# Altium project Main_MCU_Board.PrjPcb
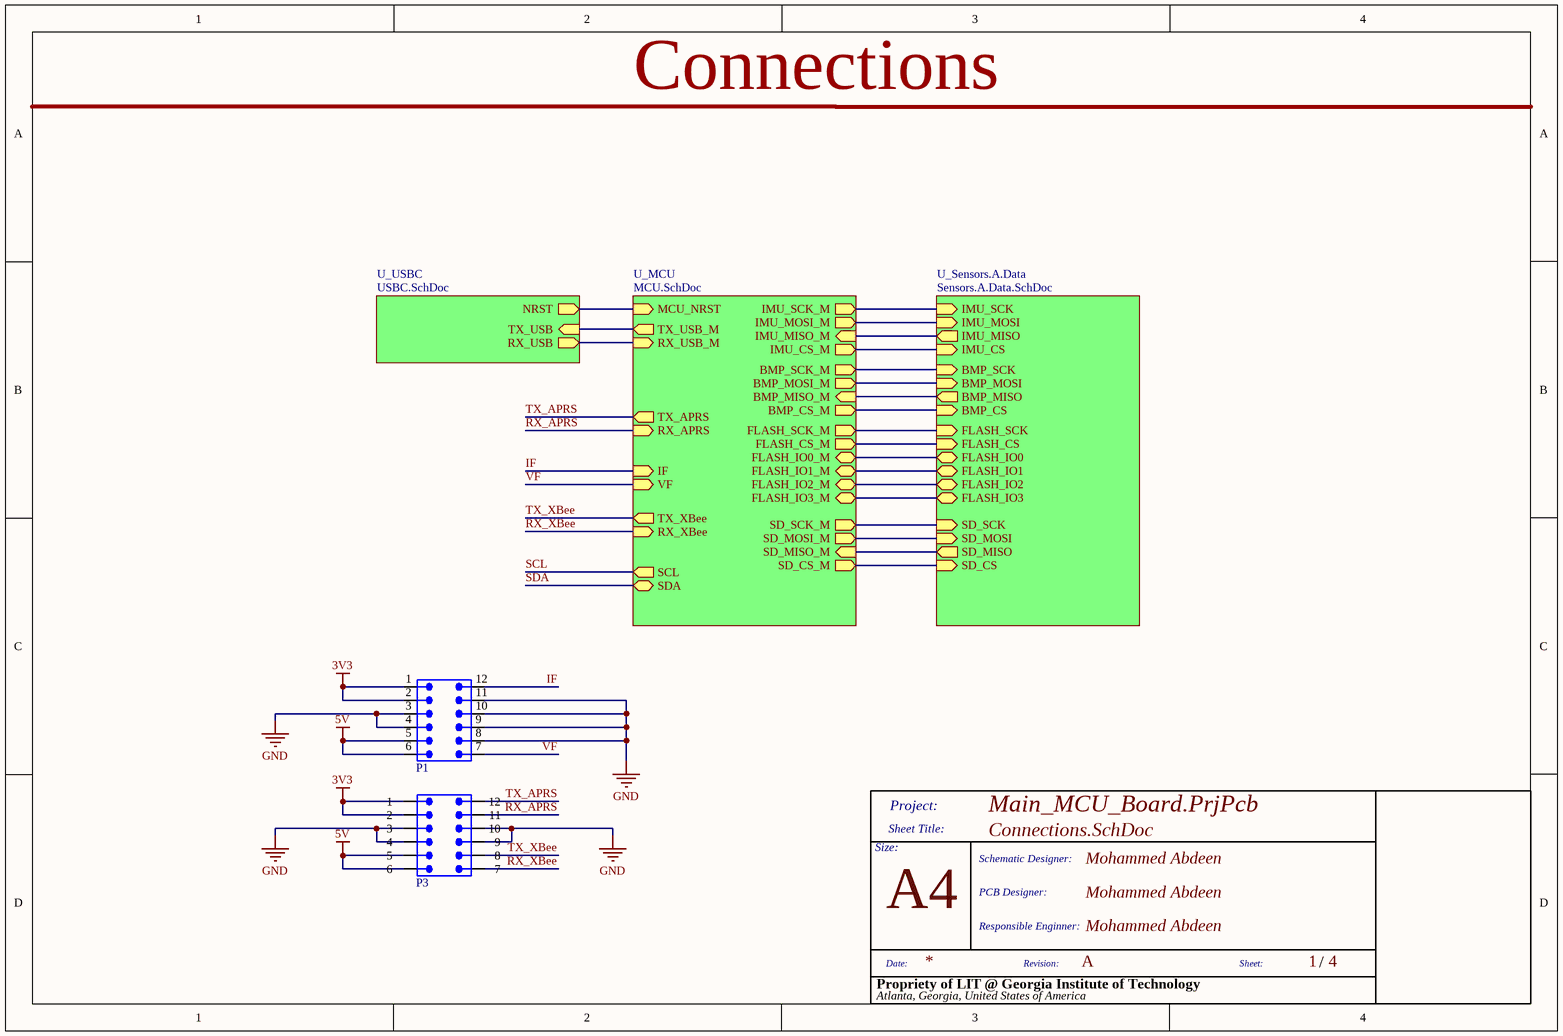
[diagram p0: Connections.SchDoc]
PCB_Engineer: Mohammed Abdeen; RE: Mohammed Abdeen; SCH_Engineer: Mohammed Abdeen; VersionRevision: A
4 sheets, 53 parts. Net scope: hierarchical (ports join the sheet entries above them; power ports are global).
Board file: MainBoard.PcbDoc
Sheets:
  Connections.SchDoc
    U_Sensors.A.Data = Sensors.A.Data.SchDoc
    U_USBC = USBC.SchDoc
    U_MCU = MCU.SchDoc

## Sheet Connections.SchDoc
size A4; SheetNumber: 1; SheetTotal: 4

### Parts
(Parts that share a designator on the sheet are numbered #1, #2 ... from top to bottom, then left to right.)
*#1  Size: A4  (hidden comment: TitleBlock)  (graphical)
P1  HTST-106-01-L-DV-P-TR  [HTST-106-01-L-DV-P-TR]  (value not drawn)
P3  NPPC062KFMS-RC  [NPPC062KFMS-RC]  (value not drawn)

### Sub-sheets
U_MCU = MCU.SchDoc: MCU_NRST (in), IF (in), VF (in), SD_MOSI_M (out), SD_MISO_M (in), SD_SCK_M (out), SD_CS_M (out), TX_APRS (out), RX_APRS (in), RX_XBee (in), TX_XBee (out), BMP_SCK_M (out), BMP_MISO_M (in), BMP_MOSI_M (out), BMP_CS_M (out), SCL (out), SDA (bidir), IMU_SCK_M (out), IMU_MISO_M (in), IMU_MOSI_M (out), IMU_CS_M (out), TX_USB_M (out), RX_USB_M (in), FLASH_IO3_M (bidir), FLASH_IO2_M (bidir), FLASH_IO1_M (bidir), FLASH_IO0_M (bidir), FLASH_SCK_M (out), FLASH_CS_M (out)
U_Sensors.A.Data = Sensors.A.Data.SchDoc: IMU_SCK (in), IMU_MOSI (in), IMU_MISO (out), IMU_CS (in), BMP_SCK (in), BMP_MOSI (in), BMP_MISO (out), BMP_CS (in), SD_CS (in), SD_MOSI (in), SD_SCK (in), SD_MISO (out), FLASH_CS (in), FLASH_SCK (in), FLASH_IO3 (bidir), FLASH_IO0 (bidir), FLASH_IO1 (bidir), FLASH_IO2 (bidir)
U_USBC = USBC.SchDoc: NRST (out), TX_USB (in), RX_USB (out)

### Nets
3V3: P1.1 P1.2 P3.11(2) P3.12(1)
5V: P1.5 P1.6 P3.7(6) P3.8(5)
GND: P1.3 P1.4 P1.8 P1.9 P1.10 P1.11 P3.3(10) P3.4(9) P3.9(4) P3.10(3)
BMP_CS: sheet U_Sensors.A.Data/BMP_CS, sheet U_MCU/BMP_CS_M
BMP_MISO: sheet U_Sensors.A.Data/BMP_MISO, sheet U_MCU/BMP_MISO_M
BMP_MOSI: sheet U_Sensors.A.Data/BMP_MOSI, sheet U_MCU/BMP_MOSI_M
BMP_SCK: sheet U_Sensors.A.Data/BMP_SCK, sheet U_MCU/BMP_SCK_M
FLASH_CS: sheet U_Sensors.A.Data/FLASH_CS, sheet U_MCU/FLASH_CS_M
FLASH_IO0: sheet U_Sensors.A.Data/FLASH_IO0, sheet U_MCU/FLASH_IO0_M
FLASH_IO1: sheet U_Sensors.A.Data/FLASH_IO1, sheet U_MCU/FLASH_IO1_M
FLASH_IO2: sheet U_Sensors.A.Data/FLASH_IO2, sheet U_MCU/FLASH_IO2_M
FLASH_IO3: sheet U_Sensors.A.Data/FLASH_IO3, sheet U_MCU/FLASH_IO3_M
FLASH_SCK: sheet U_Sensors.A.Data/FLASH_SCK, sheet U_MCU/FLASH_SCK_M
IF: P1.12 ; sheet U_MCU/IF
IMU_CS: sheet U_Sensors.A.Data/IMU_CS, sheet U_MCU/IMU_CS_M
IMU_MISO: sheet U_Sensors.A.Data/IMU_MISO, sheet U_MCU/IMU_MISO_M
IMU_MOSI: sheet U_Sensors.A.Data/IMU_MOSI, sheet U_MCU/IMU_MOSI_M
IMU_SCK: sheet U_Sensors.A.Data/IMU_SCK, sheet U_MCU/IMU_SCK_M
NRST: sheet U_USBC/NRST, sheet U_MCU/MCU_NRST
RX_APRS: P3.2(11) ; sheet U_MCU/RX_APRS
RX_USB: sheet U_USBC/RX_USB, sheet U_MCU/RX_USB_M
RX_XBee: P3.6(7) ; sheet U_MCU/RX_XBee
SD_CS: sheet U_Sensors.A.Data/SD_CS, sheet U_MCU/SD_CS_M
SD_MISO: sheet U_Sensors.A.Data/SD_MISO, sheet U_MCU/SD_MISO_M
SD_MOSI: sheet U_Sensors.A.Data/SD_MOSI, sheet U_MCU/SD_MOSI_M
SD_SCK: sheet U_Sensors.A.Data/SD_SCK, sheet U_MCU/SD_SCK_M
TX_APRS: P3.1(12) ; sheet U_MCU/TX_APRS
TX_USB: sheet U_USBC/TX_USB, sheet U_MCU/TX_USB_M
TX_XBee: P3.5(8) ; sheet U_MCU/TX_XBee
VF: P1.7 ; sheet U_MCU/VF

### Notes on the sheet
- Connections
- (in symbol TitleBlock) Project:; Sheet Title:; Size:; Schematic Designer:; PCB Designer:; Responsible Enginner:; Date:; Revision:; Sheet:; /; Propriety of LIT @ Georgia Institute of Technology; Atlanta, Georgia, United States of America

### Library data of the parts
*#1 = TitleBlock: Standard Title Block
P1 = BoardToBoard_Bottom: Connector Header Through Hole 12 position 0.100" (2.54mm)
P3 = BoardToBoard_Top: 12 Position Receptacle Connector 0.100" (2.54mm) Through Hole Gold

## Sheet Sensors.A.Data.SchDoc
size A4; SheetNumber: 3; SheetTotal: 4
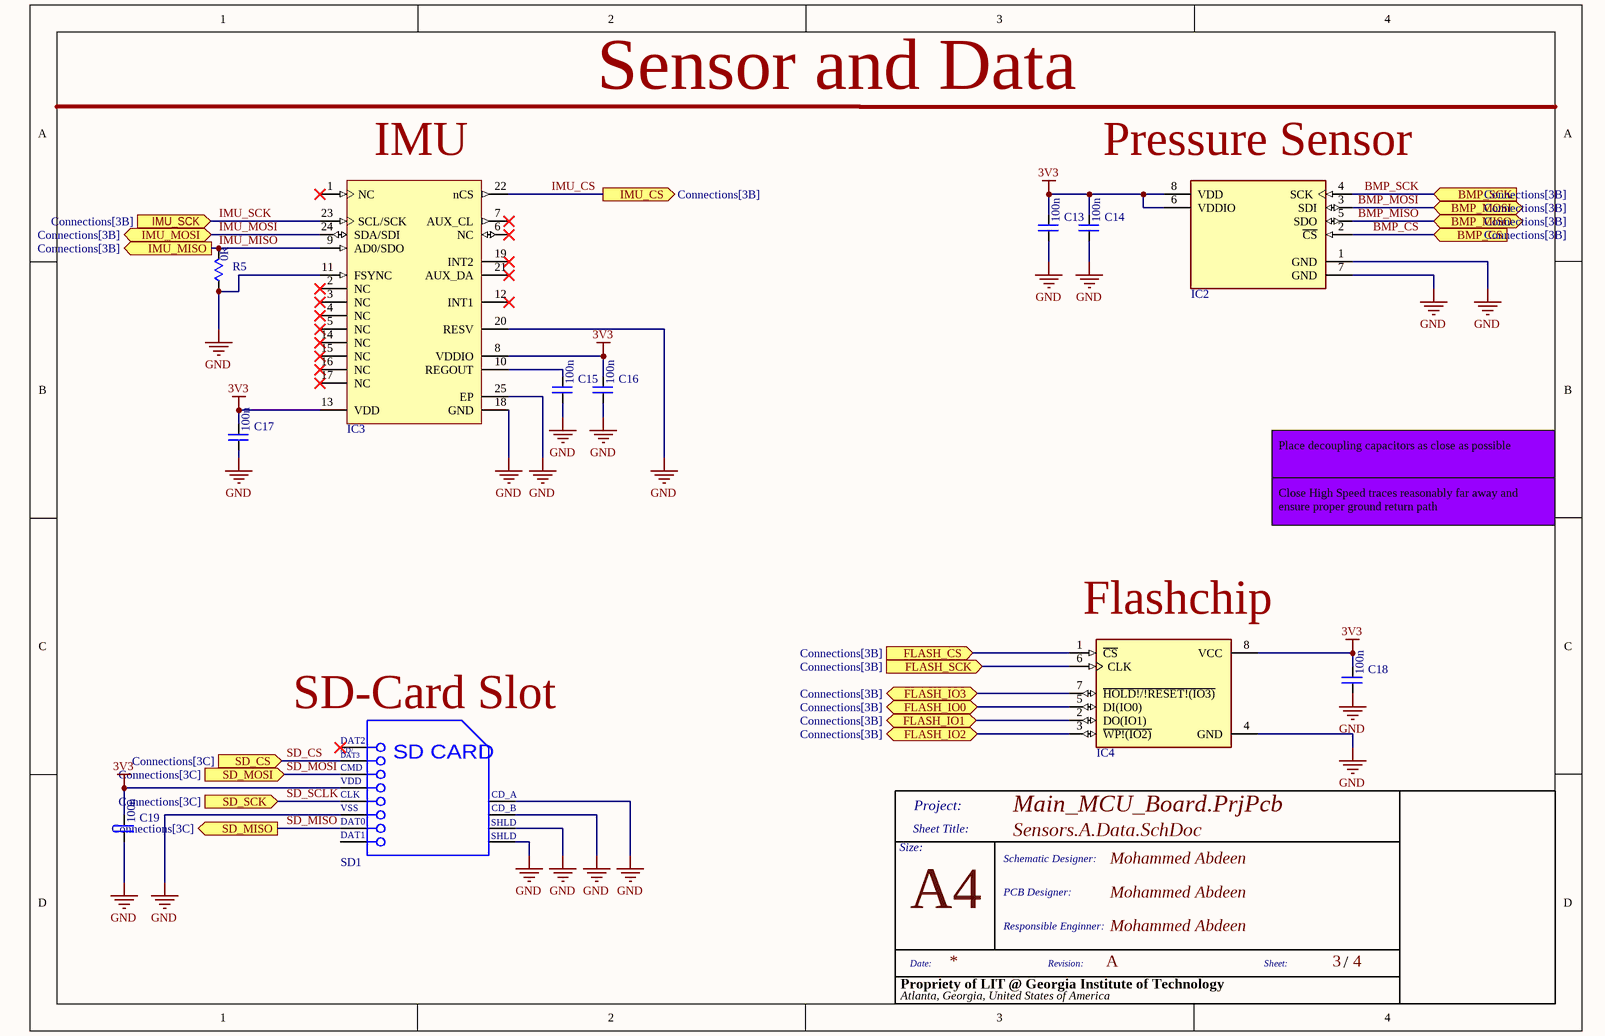
[diagram p1: Sensors.A.Data.SchDoc]

### Parts
(Parts that share a designator on the sheet are numbered #1, #2 ... from top to bottom, then left to right.)
*#2  Size: A4  (hidden comment: TitleBlock)  (graphical)
C13  KGM21NR71E104KT  [CAP-0805]  (value not drawn)
C14  KGM21NR71E104KT  [CAP-0805]  (value not drawn)
C15  KGM21NR71E104KT  [CAP-0805]  (value not drawn)
C16  KGM21NR71E104KT  [CAP-0805]  (value not drawn)
C17  KGM21NR71E104KT  [CAP-0805]  (value not drawn)
C18  KGM21NR71E104KT  [CAP-0805]  (value not drawn)
C19  KGM21NR71E104KT  [CAP-0805]  (value not drawn)
IC2  BME280  [BME280]  (value not drawn)
IC3  ICM-20649  [24-QFN]  (value not drawn)
IC4  W25Q32JVSSIQ  [F-SOIC127P790X216-8N]  (value not drawn)
R5  ERJ-6GEY0R00V  [0805-RES]  (value not drawn)
SD1  1040310811  [MOLX-104031-0811_V]  (value not drawn)

### Ports
BMP_CS (in, see Connections[3B]), BMP_MISO (bidir, see Connections[3B]), BMP_MOSI (bidir, see Connections[3B]), BMP_SCK (in, see Connections[3B]), FLASH_CS (in, see Connections[3B]), FLASH_IO0 (bidir, see Connections[3B]), FLASH_IO1 (bidir, see Connections[3B]), FLASH_IO2 (bidir, see Connections[3B]), FLASH_IO3 (bidir, see Connections[3B]), FLASH_SCK (in, see Connections[3B]), IMU_CS (out, see Connections[3B]), IMU_MISO (out, see Connections[3B]), IMU_MOSI (bidir, see Connections[3B]), IMU_SCK (in, see Connections[3B]), SD_CS (in, see Connections[3C]), SD_MISO (out, see Connections[3C]), SD_MOSI (in, see Connections[3C]), SD_SCK (in, see Connections[3C])

### Nets
3V3: C13.2 C14.2 C16.2 C17.2 C18.2 C19.2 IC2.6(VDDIO) IC2.8(VDD) IC3.8(VDDIO) IC3.13(VDD) IC4.8(VCC) SD1.4(VDD)
GND: C13.1 C14.1 C15.1 C16.1 C17.1 C18.1 C19.1 IC2.1(GND) IC2.7(GND) IC3.11(FSYNC) IC3.18(GND) IC3.20(RESV) IC3.25(EP) IC4.4(GND) R5.1 SD1.6(VSS2) SD1.9(CD_A) SD1.10(CD_B) SD1.11(SHLD1) SD1.12(SHLD2)
BMP_CS: IC2.2(~{CS}) ; port BMP_CS
BMP_MISO: IC2.5(SDO) ; port BMP_MISO
BMP_MOSI: IC2.3(SDI) ; port BMP_MOSI
BMP_SCK: IC2.4(SCK) ; port BMP_SCK
FLASH_CS: IC4.1(~{CS}) ; port FLASH_CS
FLASH_IO0: IC4.5(DI(IO0)) ; port FLASH_IO0
FLASH_IO1: IC4.2(DO(IO1)) ; port FLASH_IO1
FLASH_IO2: IC4.3(~{WP!(IO2)}) ; port FLASH_IO2
FLASH_IO3: IC4.7(~{HOLD!/!RESET!(IO3)}) ; port FLASH_IO3
FLASH_SCK: IC4.6(CLK) ; port FLASH_SCK
IMU_CS: IC3.22(nCS) ; port IMU_CS
IMU_MISO: IC3.9(AD0/SDO) R5.2 ; port IMU_MISO
IMU_MOSI: IC3.24(SDA/SDI) ; port IMU_MOSI
IMU_SCK: IC3.23(SCL/SCK) ; port IMU_SCK
SD_CS: SD1.2(CMD) ; port SD_CS
SD_MISO: SD1.7(DAT0) ; port SD_MISO
SD_MOSI: SD1.3(VSS1) ; port SD_MOSI
SD_SCLK: SD1.5(CLK) ; port SD_SCK  [project net SD_SCK]
NetC15_2: C15.2 IC3.10(REGOUT)

Not connected (* = marked no-connect by the designer): IC3 1(NC)* 2(NC)* 3(NC)* 4(NC)* 5(NC)* 6(NC)* 7(AUX_CL)* 12(INT1)* 14(NC)* 15(NC)* 16(NC)* 17(NC)* 19(INT2)* 21(AUX_DA)*; SD1 1(CD/DAT3)* 8(DAT1)

### Notes on the sheet
- Sensor and Data
- (near IC3) IMU
- (near IC2) Pressure Sensor
- Close High Speed traces reasonably far away and ensure proper ground return path
- Place decoupling capacitors as close as possible
- (near IC4) Flashchip
- (near SD1) SD-Card Slot
- (in symbol CAP-0805-25V-100n) 100n
- (in symbol microSD-card-connector) DAT2; CD/; DAT3; SD CARD; VSS; SHLD
- (in symbol RES-0805-0R) 0R
- (in symbol TitleBlock) Project:; Sheet Title:; Size:; Schematic Designer:; PCB Designer:; Responsible Enginner:; Date:; Revision:; Sheet:; /; Propriety of LIT @ Georgia Institute of Technology; Atlanta, Georgia, United States of America

### Library data of the parts
*#2 = TitleBlock: Standard Title Block
C13-C19 = CAP-0805-25V-100n: 0.1 µF ±10% 25V Ceramic Capacitor X7R 0805 (2012 Metric)
IC2 = BME280: Pressure Sensor 4.35PSI ~ 15.95PSI (30kPa ~ 110kPa) Absolute 16b 8-SMD
IC3 = IMU-ICM20649-SPI: Accelerometer, Gyroscope, Temperature, 6 Axis Sensor I2C, SPI Output
IC4 = Flashchip-32MBIT-3V3: FLASH - NOR Memory IC 32Mbit SPI - Quad I/O 133 MHz 8-SOIC
R5 = RES-0805-0R: 0 Ohms Jumper Chip Resistor 0805 (2012 Metric) Automotive AEC-Q200 Thick Film
SD1 = microSD-card-connector: 10 (8 + 2) Position Card Connector Secure Digital - microSD™ Surface Mount, Right Angle Gold; Manufacturer: Molex; Parameter 2: 1040310811

## Sheet USBC.SchDoc
size A4; SheetNumber: 4; SheetTotal: 4
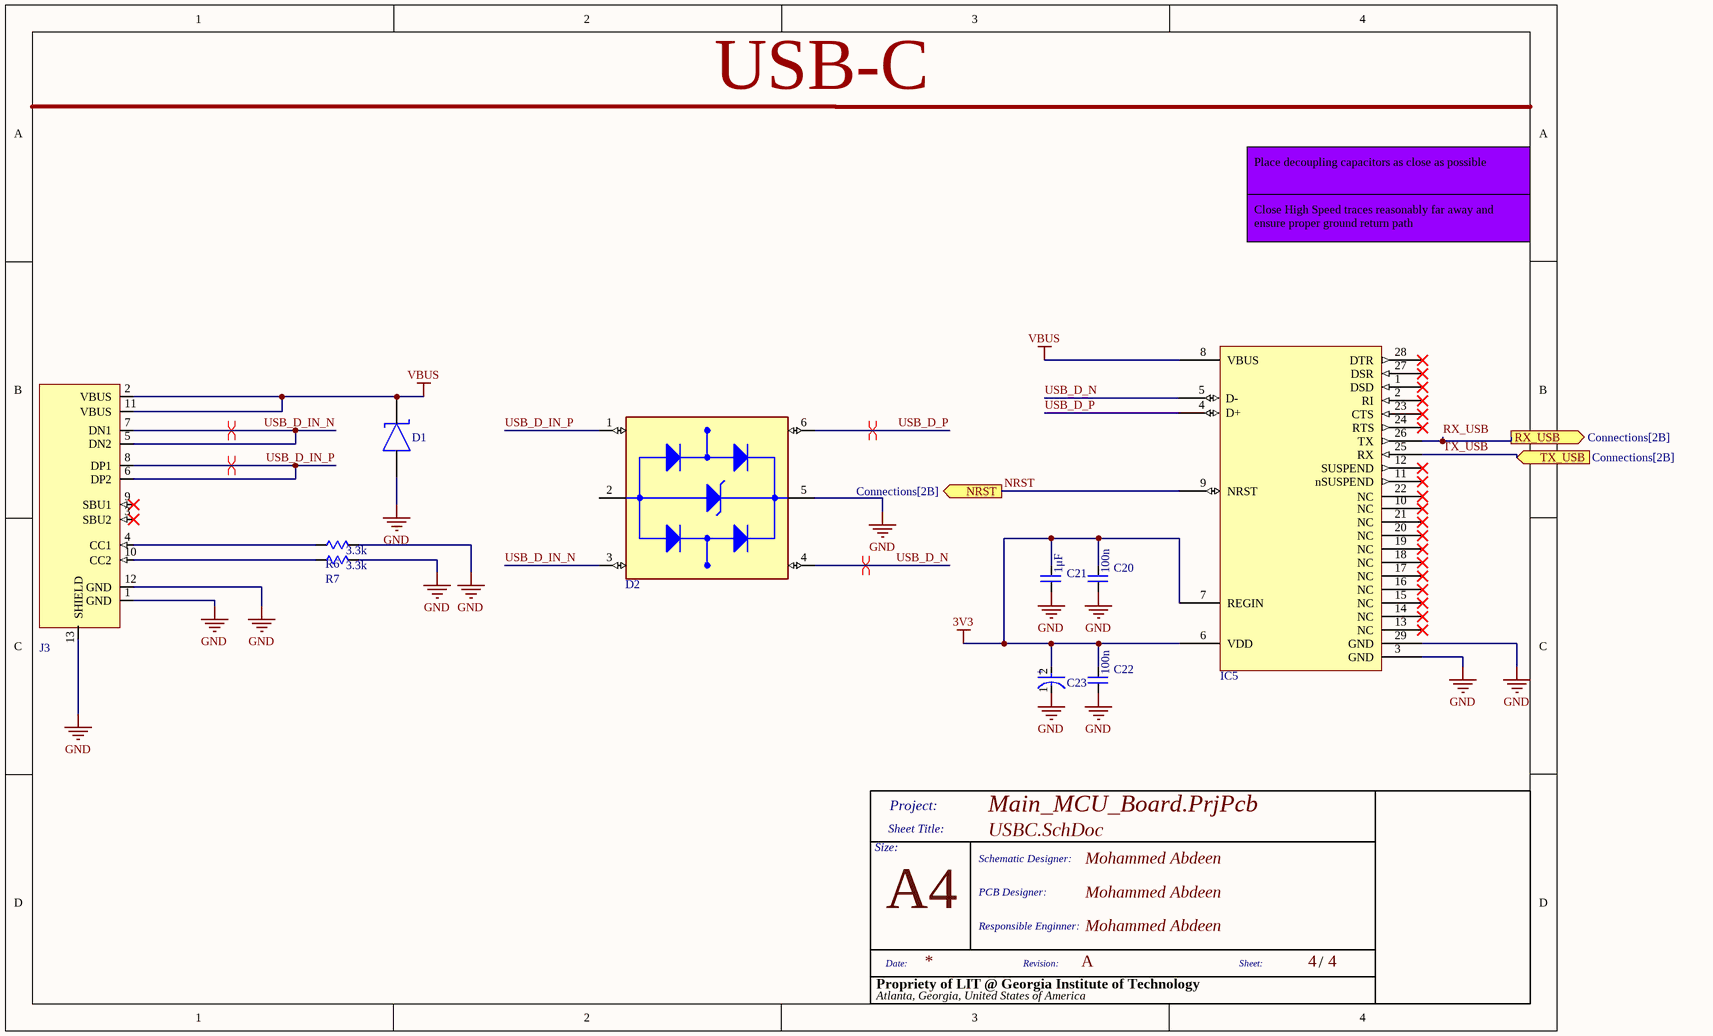
[diagram p2: USBC.SchDoc]

### Parts
(Parts that share a designator on the sheet are numbered #1, #2 ... from top to bottom, then left to right.)
*#3  Size: A4  (hidden comment: TitleBlock)  (graphical)
C20  KGM21NR71E104KT  [0805-RES]  (value not drawn)
C21  C0603C105Z8VAC7867  [0603-CAP]  (value not drawn)
C22  KGM21NR71E104KT  [0805-RES]  (value not drawn)
C23  865080640004  [865080640004]  (value not drawn)
D1  PESD5V0X1UB,135  [PESD5V0X1UB,135]  (value not drawn)
D2  USBLC6-2SC6  [SOT95P280X145-6N]  (value not drawn)
IC5  CP2102-GMR  [28-VFQFN]  (value not drawn)
J3  USB4105-GF-A  [USB4105-GF-A]  (value not drawn)
R6  ERA-3AEB332V  [0603-RES]  (value not drawn)
R7  ERA-3AEB332V  [0603-RES]  (value not drawn)

### Ports
NRST (out, see Connections[2B]), RX_USB (out, see Connections[2B]), TX_USB (in, see Connections[2B])

### Nets
3V3: C20.2 C21.2 C22.2 C23.2(A) IC5.6(VDD) IC5.7(REGIN)
GND: C20.1 C21.1 C22.1 C23.1(C) D1.1 D2.5(VBUS) IC5.3(GND) IC5.29(GND) J3.1(GND) J3.12(GND) J3.13(SHIELD) R6.2 R7.2
VBUS: D1.2 IC5.8(VBUS) J3.2(VBUS) J3.11(VBUS)
NRST: IC5.9(NRST) ; port NRST
RX_USB: IC5.26(TX) ; port RX_USB
TX_USB: IC5.25(RX) ; port TX_USB
USB_D_IN_N: D2.3(I/O2_IN) J3.5(DN2) J3.7(DN1)
USB_D_IN_P: D2.1(I/O1_IN) J3.6(DP2) J3.8(DP1)
USB_D_N: D2.4(I/O2_OUT) IC5.5(D-)
USB_D_P: D2.6(I/O1_OUT) IC5.4(D+)
NetJ3_4: J3.4(CC1) R6.1
NetJ3_10: J3.10(CC2) R7.1

Not connected (* = marked no-connect by the designer): D2 2(GND); IC5 1(DSD)* 2(RI)* 10(NC)* 11(nSUSPEND)* 12(SUSPEND)* 13(NC)* 14(NC)* 15(NC)* 16(NC)* 17(NC)* 18(NC)* 19(NC)* 20(NC)* 21(NC)* 22(NC)* 23(CTS)* 24(RTS)* 27(DSR)* 28(DTR)*; J3 3(SBU2)* 9(SBU1)*

### Layout directives
differential pair; differential pair class USB_IN: USB_D_IN_N, USB_D_IN_P
differential pair; differential pair class USB: USB_D_N, USB_D_P

### Notes on the sheet
- USB-C
- Close High Speed traces reasonably far away and ensure proper ground return path
- Place decoupling capacitors as close as possible
- (in symbol CAP-0603-10V-1uF) 1μF
- (in symbol CAP-0805-25V-100n) 100n
- (in symbol CAP-RADIALSMD-4.7uF(BIAS)) +
- (in symbol RES-0603-3.3k) 3.3k
- (in symbol TitleBlock) Project:; Sheet Title:; Size:; Schematic Designer:; PCB Designer:; Responsible Enginner:; Date:; Revision:; Sheet:; /; Propriety of LIT @ Georgia Institute of Technology; Atlanta, Georgia, United States of America

### Library data of the parts
*#3 = TitleBlock: Standard Title Block
C20 C22 = CAP-0805-25V-100n: as C13 on sheet Sensors.A.Data
C21 = CAP-0603-10V-1uF: 1 µF -20%, +80% 10V Ceramic Capacitor Y5V (F) 0603 (1608 Metric)
C23 = CAP-RADIALSMD-4.7uF(BIAS): 4.7 µF 50 V Aluminum Electrolytic Capacitors Radial, Can - SMD 2000 Hrs @ 105°C
D1 = TVS-8V-5.8V: 8V (Typ) Clamp 1.5A (8/20µs) Ipp Tvs Diode Surface Mount SOD-523; pin to pad: 1>2 2>1
D2 = TVS-6V-17V: 17V Clamp 5A (8/20µs) Ipp Tvs Diode Surface Mount SOT-23-6; pin to pad: 4>6 6>4
IC5 = USbtoUART: USB Bridge, USB to UART USB 2.0 UART Interface 28-QFN (5x5); Manufacturer: Silicon Labs; Part number: CP2102-GMR
J3 = USB C: USB-C (USB TYPE-C) USB 2.0 Receptacle Connector 24 (16+8 Dummy) Position Surface Mount, Right Angle; Through Hole; pin to pad: 13>13+14+15+16; Manufacturer: GCT; Part number: USB4105-GF-A
R6 R7 = RES-0603-3.3k: 3.3 kOhms ±0.1% 0.1W, 1/10W Chip Resistor 0603 (1608 Metric) Automotive AEC-Q200 Thin Film; Manufacturer: Panasonic Electronic Components; Part number: ERA-3AEB332V

## Sheet MCU.SchDoc
size A4; SheetNumber: 2; SheetTotal: 4
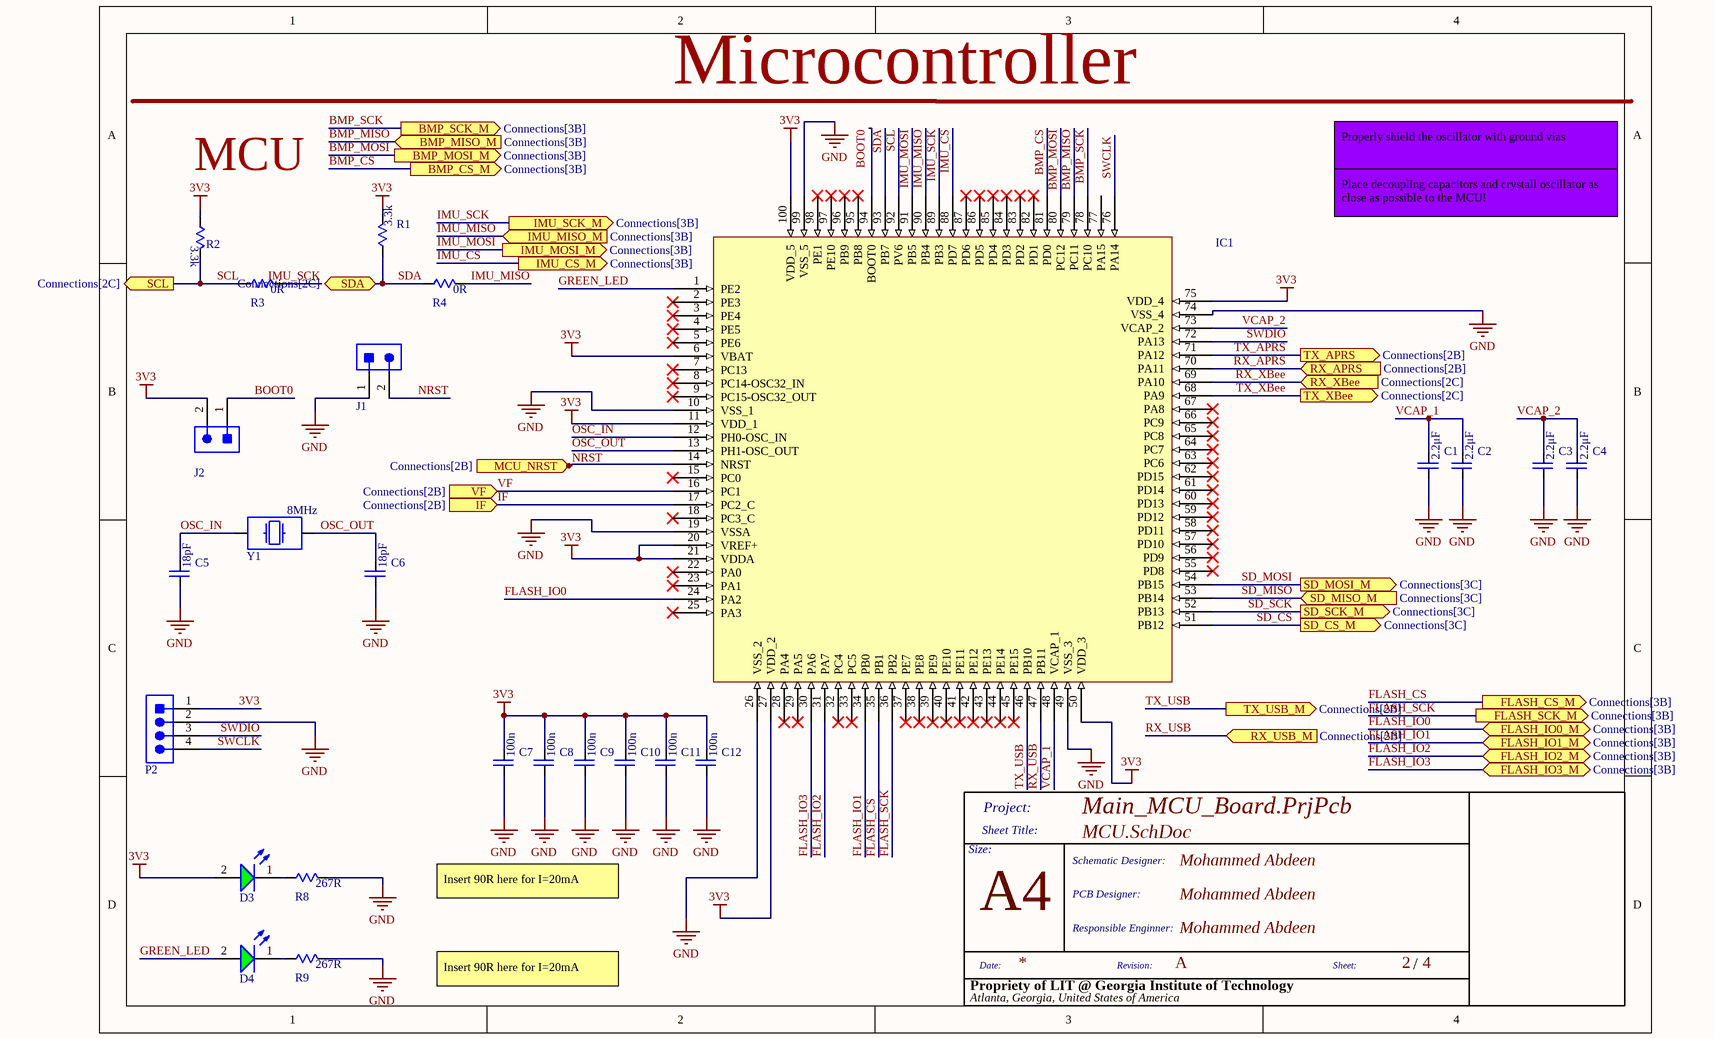
[diagram p3: MCU.SchDoc]

### Parts
(Parts that share a designator on the sheet are numbered #1, #2 ... from top to bottom, then left to right.)
*#4  Size: A4  (hidden comment: TitleBlock)  (graphical)
C1  CL10A225KO8NNNC  [0603-CAP]  (value not drawn)
C2  CL10A225KO8NNNC  [0603-CAP]  (value not drawn)
C3  CL10A225KO8NNNC  [0603-CAP]  (value not drawn)
C4  CL10A225KO8NNNC  [0603-CAP]  (value not drawn)
C5  600F180FT250XT  [CAP-0805]  (value not drawn)
C6  600F180FT250XT  [CAP-0805]  (value not drawn)
C7  KGM21NR71E104KT  [CAP-0805]  (value not drawn)
C8  KGM21NR71E104KT  [CAP-0805]  (value not drawn)
C9  KGM21NR71E104KT  [CAP-0805]  (value not drawn)
C10  KGM21NR71E104KT  [CAP-0805]  (value not drawn)
C11  KGM21NR71E104KT  [CAP-0805]  (value not drawn)
C12  KGM21NR71E104KT  [CAP-0805]  (value not drawn)
D3  LTST-C190KGKT  [FP-LTST-C190KGKT-MFG]  (value not drawn)
D4  LTST-C190KGKT  [FP-LTST-C190KGKT-MFG]  (value not drawn)
IC1  STM32H723VGT6  [QFP50P1600X1600X160-100N]  (value not drawn)
J1  61300211121  [HEADER-2-Pin]  (value not drawn)
J2  61300211121  [HEADER-2-Pin]  (value not drawn)
P2  22-27-2041  [MOLX-22-27-2041_V]  (value not drawn)
R1  ERA-3AEB332V  [0603-RES]  (value not drawn)
R2  ERA-3AEB332V  [0603-RES]  (value not drawn)
R3  ERJ-6GEY0R00V  [0805-RES]  (value not drawn)
R4  ERJ-6GEY0R00V  [0805-RES]  (value not drawn)
R8  ERJ-3EKF2670V  [0603-RES]  (value not drawn)
R9  ERJ-3EKF2670V  [0603-RES]  (value not drawn)
Y1  ABLS-8.000MHZ-B2-T  [ABLS-8.000MHZ-B2-T]  (value not drawn)

### Ports
BMP_CS_M (out, see Connections[3B]), BMP_MISO_M (in, see Connections[3B]), BMP_MOSI_M (out, see Connections[3B]), BMP_SCK_M (out, see Connections[3B]), FLASH_CS_M (out, see Connections[3B]), FLASH_IO0_M (bidir, see Connections[3B]), FLASH_IO1_M (bidir, see Connections[3B]), FLASH_IO2_M (bidir, see Connections[3B]), FLASH_IO3_M (bidir, see Connections[3B]), FLASH_SCK_M (out, see Connections[3B]), IF (in, see Connections[2B]), IMU_CS_M (out, see Connections[3B]), IMU_MISO_M (in, see Connections[3B]), IMU_MOSI_M (out, see Connections[3B]), IMU_SCK_M (out, see Connections[3B]), MCU_NRST (in, see Connections[2B]), RX_APRS (in, see Connections[2B]), RX_USB_M (in, see Connections[2B]), RX_XBee (in, see Connections[2C]), SCL (out, see Connections[2C]), SD_CS_M (out, see Connections[3C]), SD_MISO_M (in, see Connections[3C]), SD_MOSI_M (out, see Connections[3C]), SD_SCK_M (out, see Connections[3C]), SDA (bidir, see Connections[2C]), TX_APRS (out, see Connections[2B]), TX_USB_M (out, see Connections[2B]), TX_XBee (out, see Connections[2C]), VF (in, see Connections[2B])

### Nets
3V3: C7.2 C8.2 C9.2 C10.2 C11.2 C12.2 D3.2(A) IC1.6(VBAT) IC1.11(VDD_1) IC1.20(VREF+) IC1.21(VDDA) IC1.27(VDD_2) IC1.50(VDD_3) IC1.75(VDD_4) IC1.100(VDD_5) J2.2 P2.1 R1.2 R2.1
GND: C1.1 C2.1 C3.1 C4.1 C5.1 C6.1 C7.1 C8.1 C9.1 C10.1 C11.1 C12.1 IC1.10(VSS_1) IC1.19(VSSA) IC1.26(VSS_2) IC1.49(VSS_3) IC1.74(VSS_4) IC1.99(VSS_5) J1.1 P2.2 R8.2 R9.2
BMP_CS: IC1.81(PD0) ; port BMP_CS_M
BMP_MISO: IC1.79(PC11) ; port BMP_MISO_M
BMP_MOSI: IC1.80(PC12) ; port BMP_MOSI_M
BMP_SCK: IC1.78(PC10) ; port BMP_SCK_M
BOOT0: IC1.94(BOOT0) J2.1
FLASH_CS: IC1.35(PB1) ; port FLASH_CS_M
FLASH_IO0: IC1.24(PA2) ; port FLASH_IO0_M
FLASH_IO1: IC1.34(PB0) ; port FLASH_IO1_M
FLASH_IO2: IC1.31(PA7) ; port FLASH_IO2_M
FLASH_IO3: IC1.30(PA6) ; port FLASH_IO3_M
FLASH_SCK: IC1.36(PB2) ; port FLASH_SCK_M
GREEN_LED: D4.2(A) IC1.1(PE2)
IF: IC1.17(PC2_C) ; port IF
IMU_CS: IC1.88(PD7) ; port IMU_CS_M
IMU_MISO: IC1.90(PB4) R4.2 ; port IMU_MISO_M
IMU_MOSI: IC1.91(PB5) ; port IMU_MOSI_M
IMU_SCK: IC1.89(PB3) R3.2 ; port IMU_SCK_M
NRST: IC1.14(NRST) J1.2 ; port MCU_NRST
OSC_IN: C5.2 IC1.12(PH0-OSC_IN) Y1.1
OSC_OUT: C6.2 IC1.13(PH1-OSC_OUT) Y1.2
RX_APRS: IC1.70(PA11) ; port RX_APRS
RX_USB: IC1.47(PB11) ; port RX_USB_M
RX_XBee: IC1.69(PA10) ; port RX_XBee
SCL: IC1.92(PV6) R2.2 R3.1 ; port SCL
SD_CS: IC1.51(PB12) ; port SD_CS_M
SD_MISO: IC1.53(PB14) ; port SD_MISO_M
SD_MOSI: IC1.54(PB15) ; port SD_MOSI_M
SD_SCK: IC1.52(PB13) ; port SD_SCK_M
SDA: IC1.93(PB7) R1.1 R4.1 ; port SDA
SWCLK: IC1.76(PA14) P2.4
SWDIO: IC1.72(PA13) P2.3
TX_APRS: IC1.71(PA12) ; port TX_APRS
TX_USB: IC1.46(PB10) ; port TX_USB_M
TX_XBee: IC1.68(PA9) ; port TX_XBee
VCAP_1: C1.2 C2.2 IC1.48(VCAP_1)
VCAP_2: C3.2 C4.2 IC1.73(VCAP_2)
VF: IC1.16(PC1) ; port VF
NetD3_1: D3.1(K) R8.1
NetD4_1: D4.1(K) R9.1

Not connected (* = marked no-connect by the designer): IC1 2(PE3)* 3(PE4)* 4(PE5)* 5(PE6)* 7(PC13)* 8(PC14-OSC32_IN)* 9(PC15-OSC32_OUT)* 15(PC0)* 18(PC3_C)* 22(PA0)* 23(PA1)* 25(PA3)* 28(PA4)* 29(PA5)* 32(PC4)* 33(PC5)* 37(PE7)* 38(PE8)* 39(PE9)* 40(PE10)* 41(PE11)* 42(PE12)* 43(PE13)* 44(PE14)* 45(PE15)* 55(PD8)* 56(PD9)* 57(PD10)* 58(PD11)* 59(PD12)* 60(PD13)* 61(PD14)* 62(PD15)* 63(PC6)* 64(PC7)* 65(PC8)* 66(PC9)* 67(PA8)* 77(PA15) 82(PD1)* 83(PD2)* 84(PD3)* 85(PD4)* 86(PD5)* 87(PD6)* 95(PB8)* 96(PB9)* 97(PE10)* 98(PE1)*

### Notes on the sheet
- Microcontroller
- (near R2) MCU
- Properly shield the oscillator with ground vias
- Place decoupling capacitors and crystall oscillator as close as possible to the MCU!
- Insert 90R here for I=20mA
- (in symbol CAP-0603-16V) 2.2μF
- (in symbol CAP-0805-25V-100n) 100n
- (in symbol CAP-0805-250V-18pF) 18pF
- (in symbol OSC-8MHz-3V3) 8MHz
- (in symbol RES-0603-3.3k) 3.3k
- (in symbol RES-0603-267R) 267R
- (in symbol RES-0805-0R) 0R
- (in symbol TitleBlock) Project:; Sheet Title:; Size:; Schematic Designer:; PCB Designer:; Responsible Enginner:; Date:; Revision:; Sheet:; /; Propriety of LIT @ Georgia Institute of Technology; Atlanta, Georgia, United States of America

### Library data of the parts
*#4 = TitleBlock: Standard Title Block
C1-C4 = CAP-0603-16V: 2.2 µF ±10% 16V Ceramic Capacitor X5R 0603 (1608 Metric); Manufacturer: Samsung Electro-Mechanics; Part number: CL10A225KO8NNNC
C5 C6 = CAP-0805-250V-18pF: 18 pF ±1% 250V Ceramic Capacitor C0G, NP0 0805 (2012 Metric)
C7-C12 = CAP-0805-25V-100n: as C13 on sheet Sensors.A.Data
D3 D4 = LED-0603-Green_: Green 571nm LED Indication - Discrete 2V 0603 (1608 Metric)
IC1 = STMH723VGT6: ARM® Cortex®-M7 STM32H7 Microcontroller IC 32-Bit Single-Core 550MHz 1MB (1M x 8) FLASH 100-LQFP (14x14); Manufacturer: STMicroelectronics; Part number: STM32H723VGT6
J1 J2 = Header-2-Pin-Male: Connector Header Through Hole 2 position 0.100" (2.54mm); Manufacturer: Würth Elektronik; Part number: 61300211121
P2 = Header-4-Pin: Male Header, Pitch 2.54 mm, 1 x 4 Position, Height 11.7 mm, Tail Length 3.56 mm, RoHS, Bulk; Manufacturer: MOLEX; Part number: 22-27-2041
R1 R2 = RES-0603-3.3k: as R6 on sheet USBC; Part number: ERA-3AEB332V
R3 R4 = RES-0805-0R: as R5 on sheet Sensors.A.Data
R8 R9 = RES-0603-267R: 267 Ohms ±1% 0.1W, 1/10W Chip Resistor 0603 (1608 Metric) Automotive AEC-Q200 Thick Film; Manufacturer: Panasonic Electronic Components; Part number: ERJ-3EKF2670V
Y1 = OSC-8MHz-3V3: 8 MHz ±20ppm Crystal 18pF 80 Ohms HC-49/US

## Nets that join several sheets
3V3: Connections (P1.1 P1.2 P3.11 P3.12), Sensors.A.Data (12 pins), USBC (6 pins), MCU (19 pins)
GND: Connections (10 pins), Sensors.A.Data (20 pins), USBC (13 pins), MCU (22 pins)
BMP_CS: Sensors.A.Data (IC2.2), MCU (IC1.81)
BMP_MISO: Sensors.A.Data (IC2.5), MCU (IC1.79)
BMP_MOSI: Sensors.A.Data (IC2.3), MCU (IC1.80)
BMP_SCK: Sensors.A.Data (IC2.4), MCU (IC1.78)
FLASH_CS: Sensors.A.Data (IC4.1), MCU (IC1.35)
FLASH_IO0: Sensors.A.Data (IC4.5), MCU (IC1.24)
FLASH_IO1: Sensors.A.Data (IC4.2), MCU (IC1.34)
FLASH_IO2: Sensors.A.Data (IC4.3), MCU (IC1.31)
FLASH_IO3: Sensors.A.Data (IC4.7), MCU (IC1.30)
FLASH_SCK: Sensors.A.Data (IC4.6), MCU (IC1.36)
IF: Connections (P1.12), MCU (IC1.17)
IMU_CS: Sensors.A.Data (IC3.22), MCU (IC1.88)
IMU_MISO: Sensors.A.Data (IC3.9 R5.2), MCU (IC1.90 R4.2)
IMU_MOSI: Sensors.A.Data (IC3.24), MCU (IC1.91)
IMU_SCK: Sensors.A.Data (IC3.23), MCU (IC1.89 R3.2)
NRST: USBC (IC5.9), MCU (IC1.14 J1.2)
RX_APRS: Connections (P3.2), MCU (IC1.70)
RX_USB: USBC (IC5.26), MCU (IC1.47)
RX_XBee: Connections (P3.6), MCU (IC1.69)
SD_CS: Sensors.A.Data (SD1.2), MCU (IC1.51)
SD_MISO: Sensors.A.Data (SD1.7), MCU (IC1.53)
SD_MOSI: Sensors.A.Data (SD1.3), MCU (IC1.54)
SD_SCK: Sensors.A.Data (SD1.5), MCU (IC1.52)
TX_APRS: Connections (P3.1), MCU (IC1.71)
TX_USB: USBC (IC5.25), MCU (IC1.46)
TX_XBee: Connections (P3.5), MCU (IC1.68)
VF: Connections (P1.7), MCU (IC1.16)